# Altium project Switch_Matrix_32_2.PrjPCB (part 3 of 3)

## Sheet DIOT_Connectors_P1_P6.SchDoc: Switch Matrix 32:2
size 420 x 297 mm; SPICEModelCacheRMUUFYQV: <root> / <DocumentId>RMUUFYQV</DocumentId> / </root>; Author: G.Kasprowicz; CompanyName: WUT ISE; DrawnBy: G.Kasprowicz; Organization: WUT ISE; Address1: PW ISE; Address2: Nowowiejska 15/19 00-665 Warsaw; Address3: gkasprow@gmail.com; DocumentNumber: 5; Revision: 2; SheetNumber: 5; SheetTotal: 6; ModifiedBy: -; CheckedDate: -; Title2: DIOT connectors; DivGrp: WUT ISE; Designer: G.Kasprowicz; ModifiedDate: -; ProjectName: Sensor Box
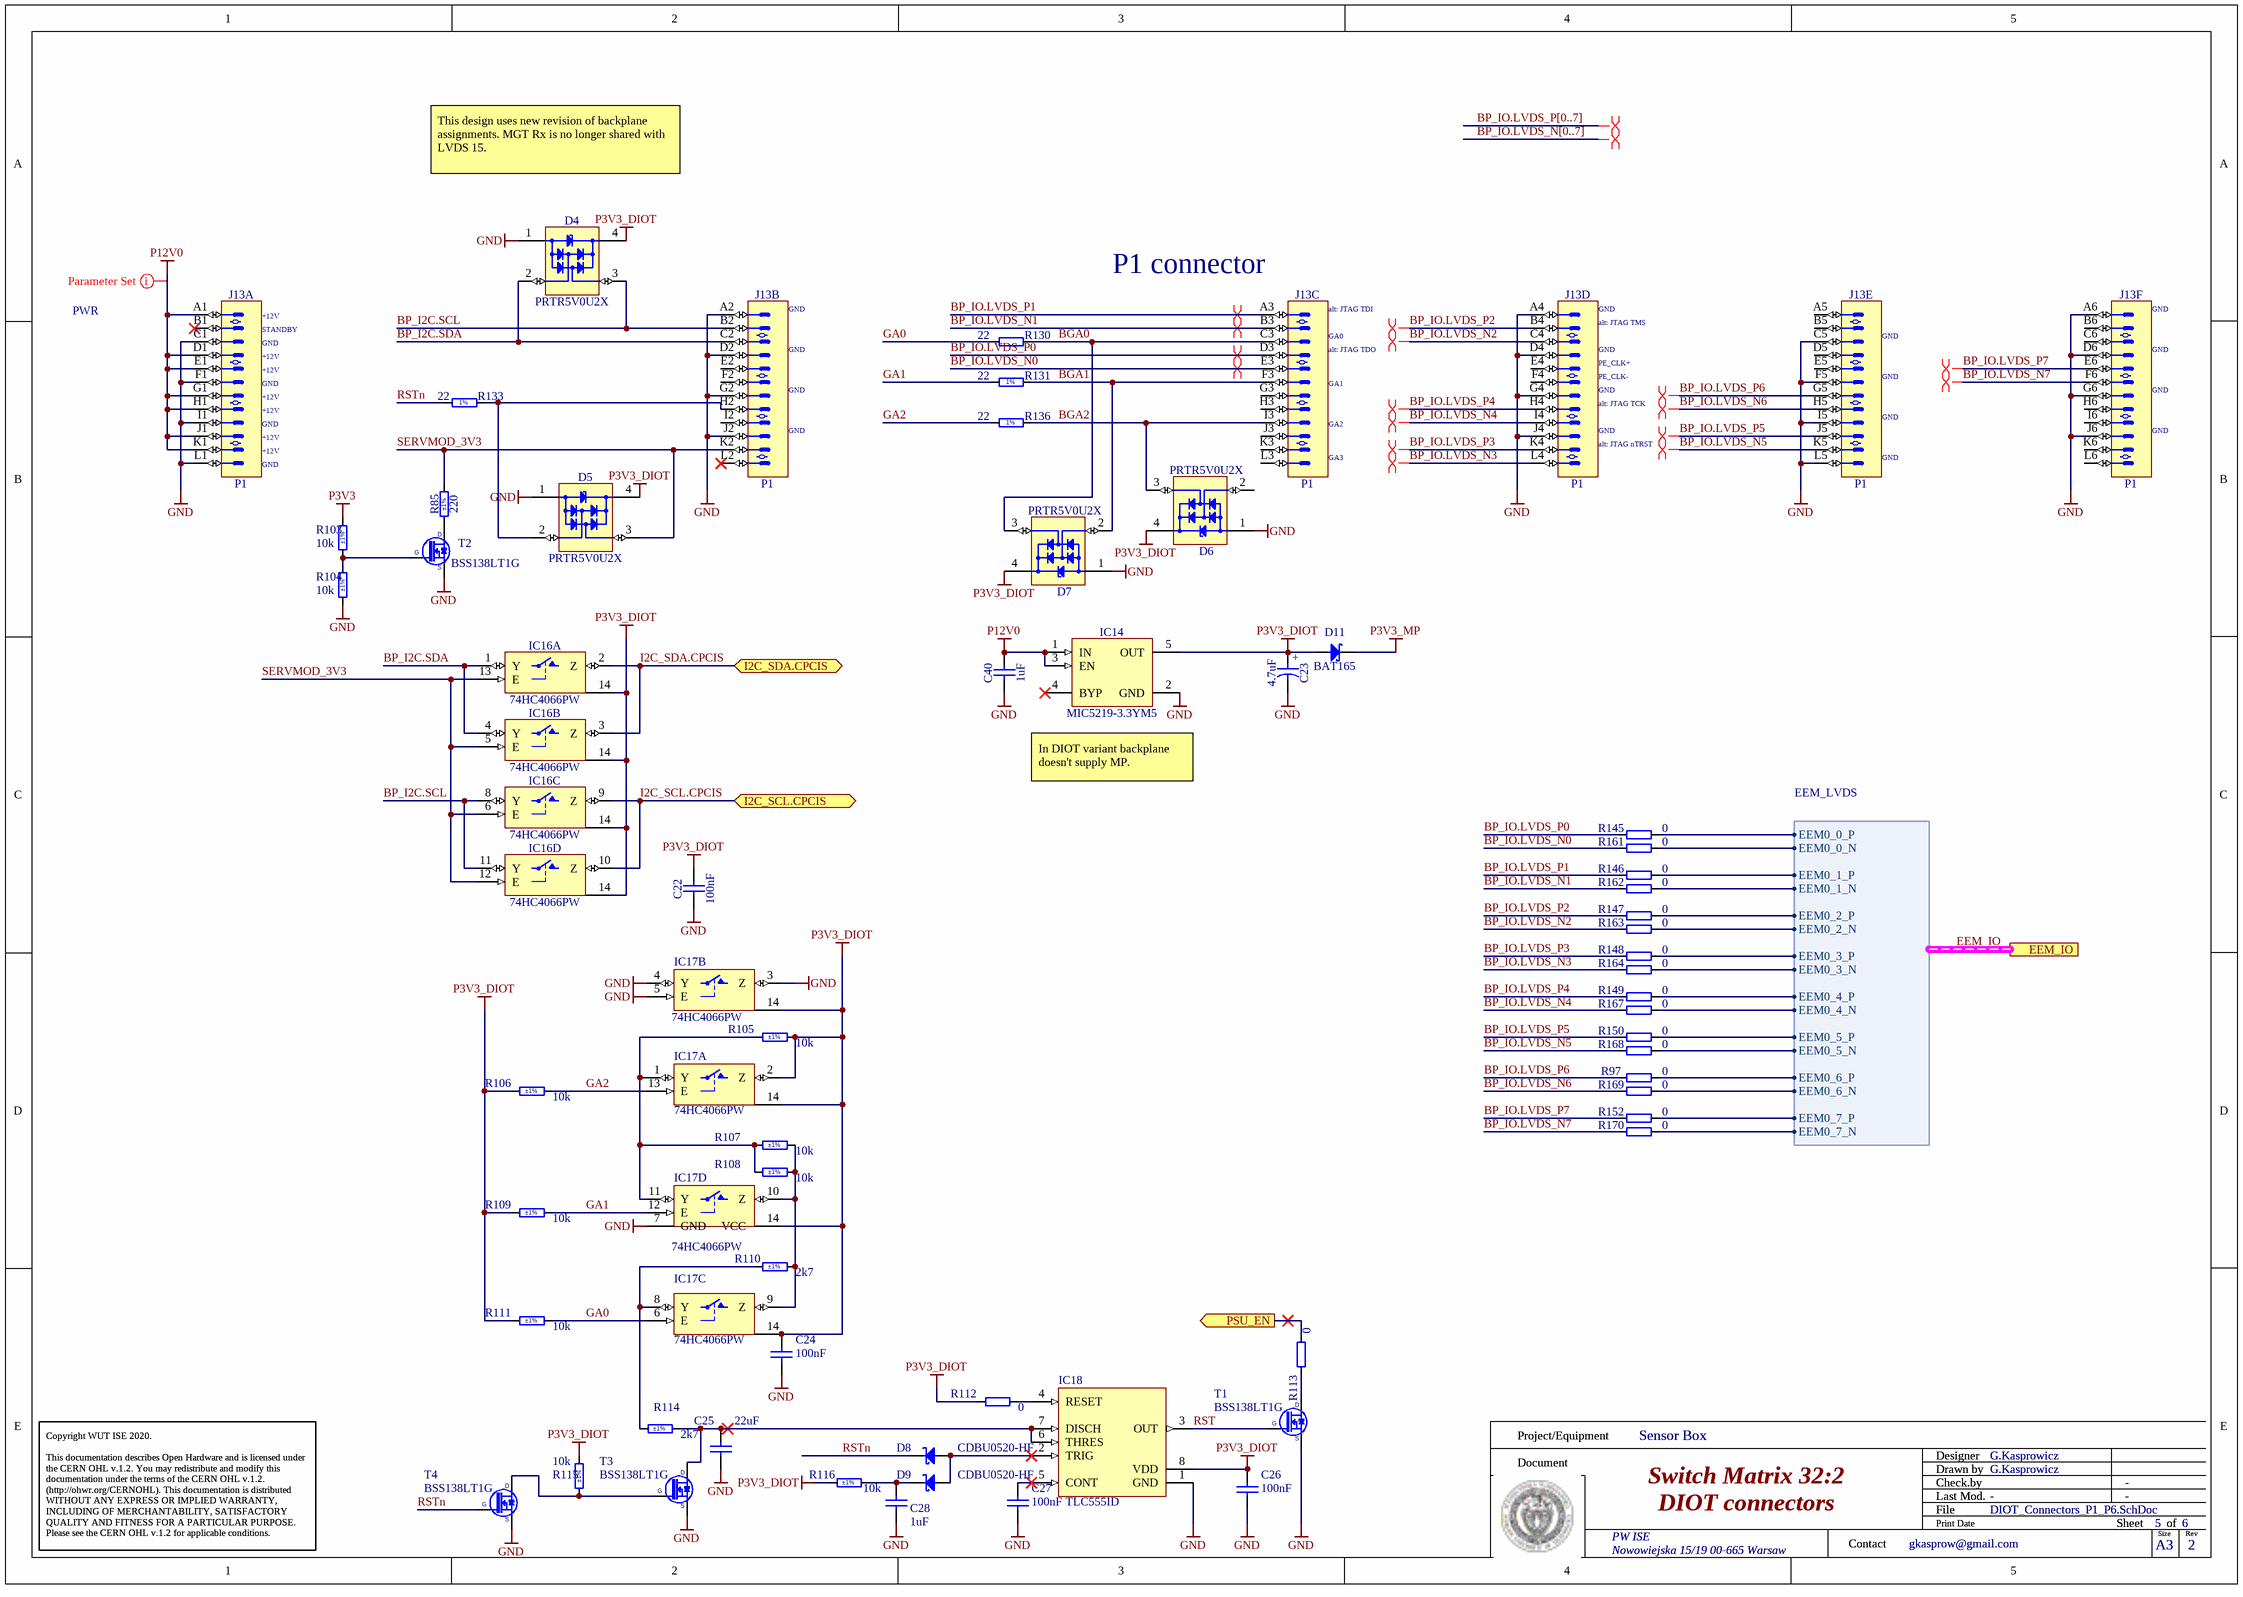
[diagram p5: DIOT_Connectors_P1_P6.SchDoc]

### Parts
C22  100nF  [CAPC1608X87N]
C23  4.7uF  [CAPMP3216X180N]
C24  100nF  [CAPC1608X87N]
C25  22uF  [CAPC2012X135N]
C26  100nF  [CAPC1608X87N]
C27  100nF  [CAPC1608X87N]
C28  1uF  [CAPC1608X87N]
C40  1uF  [CAPC1608X87N]
D4  PRTR5V0U2X  [SOT190P230X110-4N]
D5  PRTR5V0U2X  [SOT190P230X110-4N]
D6  PRTR5V0U2X  [SOT190P230X110-4N]
D7  PRTR5V0U2X  [SOT190P230X110-4N]
D8  CDBU0520-HF  [SOD-523F]
D9  CDBU0520-HF  [SOD-523F]
D11  BAT165  [SOD2512X110N]
IC14  MIC5219-3.3YM5  [SOT95P280X145-5N]
IC16  74HC4066PW  [SOP65P640X110-14N]  (parts A,B,C,D of 4)
IC17  74HC4066PW  [SOP65P640X110-14N]  (parts A,B,C,D of 4)
IC18  TLC555ID  [SOIC127P600X175-8N]
J13  P1  [AMPHENOL_10052825-101LF]  (parts A,B,C,D,E,F of 6)
R85  220  Tolerance: ±1%  [RESC1005X40N]
R97  0  [RESC1608X55N]
R103  10k  Tolerance: ±1%  [RESC1608X55N]
R104  10k  Tolerance: ±1%  [RESC1608X55N]
R105  10k  Tolerance: ±1%  [RESC1608X55N]
R106  10k  Tolerance: ±1%  [RESC1608X55N]
R107  10k  Tolerance: ±1%  [RESC1608X55N]
R108  10k  Tolerance: ±1%  [RESC1608X55N]
R109  10k  Tolerance: ±1%  [RESC1608X55N]
R110  2k7  Tolerance: ±1%  [RESC1608X55N]
R111  10k  Tolerance: ±1%  [RESC1608X55N]
R112  0  [RESC1608X55N]
R113  0  [RESC1608X55N]
R114  2k7  Tolerance: ±1%  [RESC1608X55N]
R115  10k  Tolerance: ±1%  [RESC1608X55N]
R116  10k  Tolerance: ±1%  [RESC1608X55N]
R130  22  [RESC1005X40N]
R131  22  [RESC1005X40N]
R133  22  [RESC1005X40N]
R136  22  [RESC1005X40N]
R145  0  [RESC1608X55N]
R146  0  [RESC1608X55N]
R147  0  [RESC1608X55N]
R148  0  [RESC1608X55N]
R149  0  [RESC1608X55N]
R150  0  [RESC1608X55N]
R152  0  [RESC1608X55N]
R161  0  [RESC1608X55N]
R162  0  [RESC1608X55N]
R163  0  [RESC1608X55N]
R164  0  [RESC1608X55N]
R167  0  [RESC1608X55N]
R168  0  [RESC1608X55N]
R169  0  [RESC1608X55N]
R170  0  [RESC1608X55N]
T1  BSS138LT1G  [SOT95P240X110-3N]
T2  BSS138LT1G  [SOT95P240X110-3N]
T3  BSS138LT1G  [SOT95P240X110-3N]
T4  BSS138LT1G  [SOT95P240X110-3N]

### Ports
EEM_IO (harness EEM_LVDS), I2C_SCL.CPCIS (bidir), I2C_SDA.CPCIS (bidir), PSU_EN (out)

### Harnesses
EEM_LVDS: EEM0_0_P, EEM0_0_N, EEM0_1_P, EEM0_1_N, EEM0_2_P, EEM0_2_N, EEM0_3_P, EEM0_3_N, EEM0_4_P, EEM0_4_N, EEM0_5_P, EEM0_5_N, EEM0_6_P, EEM0_6_N, EEM0_7_P, EEM0_7_N

### Nets
GND: C22.1 C23.2 C24.1 C25.1 C26.1 C27.1 C28.1 C40.1 D4.1(GND) D5.1(GND) D6.1(GND) D7.1(GND) IC14.2(GND) IC16.7(GND) IC17.3(Z) IC17.4(Y) IC17.5(E) IC17.7(GND) IC18.1(GND) J13.A2 J13.A4 J13.A6 J13.C1 J13.C5 J13.D2 J13.D4 J13.D6 J13.F1 J13.F5 J13.G2 J13.G4 J13.G6 J13.I1 J13.I5 J13.J2 J13.J4 J13.J6 J13.L1 J13.L5 R104.1 T1.2(S) T2.2(S) T3.2(S) T4.2(S)
P3V3: R103.2
P3V3_DIOT: C22.2 C23.1 C24.2 C26.2 D4.4(VCC) D5.4(VCC) D6.4(VCC) D7.4(VCC) D11.2(A) IC14.5(OUT) IC16.14(VCC) IC17.2(Z) IC17.14(VCC) IC18.8(VDD) R105.2 R106.1 R109.1 R111.1 R112.1 R115.2 R116.1
P3V3_MP: D11.1(C)
P12V0: C40.2 IC14.1(IN) IC14.3(EN) J13.A1 J13.D1 J13.E1 J13.G1 J13.H1 J13.J1 J13.K1
BGA0: D7.3(I/O2) J13.C3 R130.2
BGA1: D7.2(I/O1) J13.F3 R131.2
BGA2: D6.3(I/O2) J13.I3 R136.2
BP_I2C.SCL: D4.3(I/O2) IC16.8(Y) IC16.11(Y) J13.B2
BP_I2C.SDA: D4.2(I/O1) IC16.1(Y) IC16.4(Y) J13.C2
BP_IO.LVDS_N0: J13.E3 R161.1
BP_IO.LVDS_N1: J13.B3 R162.1
BP_IO.LVDS_N2: J13.C4 R163.1
BP_IO.LVDS_N3: J13.L4 R164.1
BP_IO.LVDS_N4: J13.I4 R167.1
BP_IO.LVDS_N5: J13.K5 R168.1
BP_IO.LVDS_N6: J13.H5 R169.1
BP_IO.LVDS_N7: J13.F6 R170.1
BP_IO.LVDS_P0: J13.D3 R145.1
BP_IO.LVDS_P1: J13.A3 R146.1
BP_IO.LVDS_P2: J13.B4 R147.1
BP_IO.LVDS_P3: J13.K4 R148.1
BP_IO.LVDS_P4: J13.H4 R149.1
BP_IO.LVDS_P5: J13.J5 R150.1
BP_IO.LVDS_P6: J13.G5 R97.1
BP_IO.LVDS_P7: J13.E6 R152.1
EEM0_0_N: R161.2 ; port EEM_IO.EEM0_0_N
EEM0_0_P: R145.2 ; port EEM_IO.EEM0_0_P
EEM0_1_N: R162.2 ; port EEM_IO.EEM0_1_N
EEM0_1_P: R146.2 ; port EEM_IO.EEM0_1_P
EEM0_2_N: R163.2 ; port EEM_IO.EEM0_2_N
EEM0_2_P: R147.2 ; port EEM_IO.EEM0_2_P
EEM0_3_N: R164.2 ; port EEM_IO.EEM0_3_N
EEM0_3_P: R148.2 ; port EEM_IO.EEM0_3_P
EEM0_4_N: R167.2 ; port EEM_IO.EEM0_4_N
EEM0_4_P: R149.2 ; port EEM_IO.EEM0_4_P
EEM0_5_N: R168.2 ; port EEM_IO.EEM0_5_N
EEM0_5_P: R150.2 ; port EEM_IO.EEM0_5_P
EEM0_6_N: R169.2 ; port EEM_IO.EEM0_6_N
EEM0_6_P: R97.2 ; port EEM_IO.EEM0_6_P
EEM0_7_N: R170.2 ; port EEM_IO.EEM0_7_N
EEM0_7_P: R152.2 ; port EEM_IO.EEM0_7_P
GA0: IC17.6(E) R111.2 R130.1
GA1: IC17.12(E) R109.2 R131.1
GA2: IC17.13(E) R106.2 R136.1
I2C_SCL.CPCIS: IC16.9(Z) IC16.10(Z) ; port I2C_SCL.CPCIS  [project net I2C0_SCL]
I2C_SDA.CPCIS: IC16.2(Z) IC16.3(Z) ; port I2C_SDA.CPCIS  [project net I2C0_SDA]
RST: IC18.3(OUT) T1.1(G)
RSTn: D8.1(C) R133.1 T4.1(G)
SERVMOD_3V3: D5.3(I/O2) IC16.5(E) IC16.6(E) IC16.12(E) IC16.13(E) J13.K2 R85.2
NetC25_2: C25.2 IC18.6(THRES) IC18.7(DISCH) R114.2 T3.3(D)
NetC27_2: C27.2 IC18.5(CONT)
NetC28_2: C28.2 D9.1(C) R116.2
NetD5_2: D5.2(I/O1) J13.H2 R133.2
NetD8_2: D8.2(A) D9.2(A) IC18.2(TRIG)
NetIC17_1: IC17.1(Y) IC17.11(Y) R105.1 R107.1 R108.1
NetIC17_8: IC17.8(Y) R110.1 R114.1
NetIC17_9: IC17.9(Z) IC17.10(Z) R107.2 R108.2 R110.2
NetIC18_4: IC18.4(RESET) R112.2
NetIC22_5: R113.2 ; port PSU_EN
NetR85_1: R85.1 T2.3(D)
NetR103_1: R103.1 R104.2 T2.1(G)
NetR113_1: R113.1 T1.3(D)
NetR115_1: R115.1 T3.1(G) T4.3(D)

Not connected (* = marked no-connect by the designer): D6 2(I/O1); IC14 4(BYP)*; J13 A5 B1* B5 B6 C6 D5 E2 E4 E5 F2 F4 G3 H3 H6 I2 I6 J3 K3 K6 L2* L3 L6

### Buses and harness runs
bus BP_IO.LVDS_N[0..7]
bus BP_IO.LVDS_P[0..7]
harness EEM_IO = port EEM_IO

### Layout directives
differential pair: (no net found under the mark), BP_IO.LVDS_N0, BP_IO.LVDS_N1, BP_IO.LVDS_N2, BP_IO.LVDS_N3, BP_IO.LVDS_N4, BP_IO.LVDS_N5, BP_IO.LVDS_N6, BP_IO.LVDS_N7, BP_IO.LVDS_P0, BP_IO.LVDS_P1, BP_IO.LVDS_P2, BP_IO.LVDS_P3, BP_IO.LVDS_P4, BP_IO.LVDS_P5, BP_IO.LVDS_P6, BP_IO.LVDS_P7
net class PWR: P12V0

### Notes on the sheet
- This design uses new revision of backplane assignments. MGT Rx is no longer shared with LVDS 15.
- (near J13) +12V
- (near J13) GND
- (near J13) P1 connector
- (near J13) alt: JTAG TDI
- (near J13) alt: JTAG TMS
- (near J13) STANDBY
- (near J13) alt: JTAG TDO
- (near J13) GA1
- (near J13) GA0
- (near J13) PE_CLK+
- (near J13) PE_CLK-
- (near J13) GA2
- (near J13) GA3
- (near J13) alt: JTAG TCK
- (near J13) alt: JTAG nTRST
- In DIOT variant backplane doesn't supply MP.
- Project/Equipment
- Document
- Designer
- Drawn by
- Check.by
- Copyright WUT ISE 2020.
  This documentation describes Open Hardware and is licensed under the CERN OHL v.1.2. You may redistribute and modify this documentation under the terms of the CERN OHL v.1.2. (http://ohwr.org/CERNOHL). This documentation is distributed WITHOUT ANY EXPRESS OR IMPLIED WARRANTY, INCLUDING OF MERCHANTABILITY, SATISFACTORY QUALITY AND FITNESS FOR A PARTICULAR PURPOSE. Please see the CERN OHL v.1.2 for applicable conditions.
- Contact
- File
- Last Mod.
- Print Date
- Sheet
- Size
- A3
- of
- Rev
- (in symbol CTE3216-18_4.7UF_10V_10%_AVX_TPSA475K010T1400) +
- (in symbol R0402_22R_1%_0.0625W_100PPM) 1%

### Library data of the parts
C22 C24 C26 C27 = CC0603_100NF_50V_10%_X7R: Non-polarised capacitor; Part Description: SMD Multilayer Chip Ceramic Capacitor; Manufacturer: GENERIC; Manufacturer1 Part Number: 223858615649; Voltage: 50V; TC: X7R; Tolerance: ±10%; Part Number: CC0603_100NF_50V_10%_X7R; Component Kind: Standard; Component Type: Standard; Pin Count: 2; Value: 100nF; Status: Preferred; Manufacturer Part Number: CC0603_100NF_50V_10%_X7R; Case: 0603; Mounted: Yes; Socket: No; SMD: Yes; Sense: No; Manufacturer1 Example: PHYCOMP; Manufacturer1 ComponentHeight: 0.87mm; HelpURL: \\cern.ch\dfs\Applications\Altium\Datasheets\CC0603_X7R_PHYCOMP.pdf; Author: CERN DEM JLC; CreateDate: 03.12.2007; LatestRevisionDate: 03.12.2007
C23 = CTE3216-18_4.7UF_10V_10%_AVX_TPSA475K010T1400: Polarised capacitor; Part Description: Low ESR 1R4 Automotive Solid Tantalum Chip Capacitor; Manufacturer: AVX; Voltage: 10V; Tolerance: ±10%; Part Number: CTE3216-18_4.7UF_10V_10%_AVX_TPSA475K010T1400; Component Kind: Standard; Component Type: Standard; Pin Count: 2; Value: 4.7uF; Status: Preferred; Manufacturer Part Number: TPSA475K010T1400; Case: A; Mounted: Yes; Socket: No; SMD: Yes; Sense: No; ComponentHeight: 1.8mm; HelpURL: \\cern.ch\dfs\Applications\Altium\Datasheets\CTE-LESR_AVX_TPS-AUTO.pdf; Author: CERN DEM JLC; CreateDate: 23.01.2018; LatestRevisionDate: 23.01.2018
C25 = CC0805_22UF_16V_10%_X5R: Non-polarised capacitor; Part Description: SMD Multilayer Chip Ceramic Capacitor; Manufacturer: GENERIC; Manufacturer1 Part Number: C2012X5R1C226KT; Voltage: 16V; TC: X5R; Tolerance: ±10%; Part Number: CC0805_22UF_16V_10%_X5R; Component Kind: Standard; Component Type: Standard; Pin Count: 2; Value: 22uF; Status: Preferred; Manufacturer Part Number: CC0805_22UF_16V_10%_X5R; Case: 0805; Mounted: Yes; Socket: No; SMD: Yes; Sense: No; Manufacturer1 Example: TDK; Manufacturer1 ComponentHeight: 1.35mm; HelpURL: \\cern.ch\dfs\Applications\Altium\Datasheets\CC0805_X5R_TDK_C.pdf; Author: CERN DEM JLC; CreateDate: 25.10.2012; LatestRevisionDate: 25.10.2012
C28 = CC0603_1UF_16V_10%_X7R: Non-polarised capacitor; Part Description: SMD Multilayer Chip Ceramic Capacitor; Manufacturer: GENERIC; Manufacturer1 Part Number: 223878615663; Voltage: 16V; TC: X7R; Tolerance: ±10%; Part Number: CC0603_1UF_16V_10%_X7R; Component Kind: Standard; Component Type: Standard; Pin Count: 2; Value: 1uF; Status: None; Manufacturer Part Number: CC0603_1UF_16V_10%_X7R; Case: 0603; Mounted: Yes; Socket: No; SMD: Yes; Sense: No; Manufacturer1 Example: YAGEO PHYCOMP; Manufacturer1 ComponentHeight: 0.9mm; HelpURL: \\cern.ch\dfs\Applications\Altium\Datasheets\CC0603_X7R_PHYCOMP.pdf; Author: CERN DEM JLC; CreateDate: 03.12.2007; LatestRevisionDate: 17.04.2015
C40 = CC0603_1UF_25V_10%_X7R: Non-polarised capacitor; Part Description: SMD Multilayer Chip Ceramic Capacitor; Manufacturer: GENERIC; Manufacturer1 Part Number: GRM188R71E105KA12D; Voltage: 25V; TC: X7R; Tolerance: ±10%; Part Number: CC0603_1UF_25V_10%_X7R; Component Kind: Standard; Component Type: Standard; Pin Count: 2; Value: 1uF; Status: None; Manufacturer Part Number: CC0603_1UF_25V_10%_X7R; Case: 0603; Mounted: Yes; Socket: No; SMD: Yes; Sense: No; Manufacturer1 Example: MURATA; Manufacturer1 ComponentHeight: 0.9mm; HelpURL: \\cern.ch\dfs\Applications\Altium\Datasheets\CC0603_X7R_MURATA.pdf; Author: CERN DEM JLC; CreateDate: 18.01.2011; LatestRevisionDate: 18.01.2011
D4-D7 = PRTR5V0U2X: Ultra Low Capacitance Double Rail-to-Rail ESD Protection Diode; Part Description: Ultra Low Capacitance (1pF) Double Rail-to-Rail ESD Protection Diode (8kV); Manufacturer: NXP SEMICONDUCTORS; Voltage: 5.5V; PressFit: No; Bonding: No; Part Number: PRTR5V0U2X; Component Kind: Standard; Component Type: Standard; Device: PRTR5V0U2X; PackageDescription: SOT143B, SOT, 1.90mm Pitch; 4 Pin, 1.30mm W X 2.90mm L X 1.10mm H body, IPC Medium Density; Manufacturer Part Number: PRTR5V0U2X; Pin Count: 4; Case: SOT143B; Mounted: Yes; Socket: No; SMD: Yes; Sense: No; ComponentHeight: 1.1mm; HelpURL: \\cern.ch\dfs\Applications\Altium\Datasheets\PRTR5V0U2X.pdf; Author: CERN DEM JLC; CreateDate: 22.03.2011; LatestRevisionDate: 22.03.2011
D8 D9 = CDBU0520-HF: Schottky Diode; Part Description: 20V Surface mount Schottky Barrier Diode; Manufacturer: COMCHIP; Voltage: 20V; Power: 500mA; PressFit: No; Bonding: No; Part Number: CDBU0520-HF; Component Kind: Standard; Component Type: Standard; Device: CDBU0520-HF; PackageDescription: Small Outline Diode Flat Lead (SOD-523F), Body; 1.80mm L X 1mm W X 0.85mm H; Manufacturer Part Number: CDBU0520-HF; Pin Count: 2; Case: SOD-523F; Mounted: Yes; Socket: No; SMD: Yes; Sense: No; ComponentHeight: 1mm; HelpURL: \\cern.ch\dfs\Applications\Altium\Datasheets\CDBU0520-HF.pdf; Author: CERN DEM HF; CreateDate: 13.10.2023; LatestRevisionDate: 13.10.2023
D11 = BAT165: Schottky Diode; Manufacturer: INFINEON; Part Description: Medium Power AF Schottky Diode; Voltage: 40V; Power: 750mA; PressFit: No; Bonding: No; Manufacturer Part Number: BAT165; PackageDescription: Small Outline Diode (SOD-323), 1.70mm W X 1.25mm L X 1.10mm H body,  IPC Medium Density; Part Number: BAT165; Component Kind: Standard; Component Type: Standard; Device: BAT165; Pin Count: 2; Case: SOD323; Mounted: Yes; Socket: No; SMD: Yes; Sense: No; ComponentHeight: 1.1mm; HelpURL: \\cern.ch\dfs\Applications\Altium\Datasheets\BAT165.pdf; Author: CERN DEM JLC; CreateDate: 12.11.2014; LatestRevisionDate: 12.11.2014
IC14 = MIC5219-3.3YM5: 500mA Peak Output LDO Regulator; Part Description: 3.3V 500mA Peak Output Low Drop-Out  (LDO) Regulator; Manufacturer: MICROCHIP TECHNOLOGY; PressFit: No; Bonding: No; Part Number: MIC5219-3.3YM5; Component Kind: Standard; Component Type: Standard; Device: MIC5219-3.3YM5; PackageDescription: SOT, 0.95mm pitch; 5 pin, 1.60mm W X 2.90mm L X 1.45mm H body, IPC Medium Density; Manufacturer Part Number: MIC5219-3.3YM5; Pin Count: 5; Case: SOT23-5; Mounted: Yes; Socket: No; SMD: Yes; Sense: No; ComponentHeight: 1.45mm; HelpURL: \\cern.ch\dfs\Applications\Altium\Datasheets\MIC5219-3.3YM5.pdf; Author: CERN DEM WB; CreateDate: 2019-04-16; LatestRevisionDate: 2019-04-16
IC16 = 74HC4066PW: Part Description: Quad Single-Pole Single-Throw Analog Switch; Manufacturer: NXP SEMICONDUCTORS; PressFit: No; Bonding: No; Part Number: 74HC4066PW; Component Kind: Standard; Component Type: Standard; Device: 74HC4066PW; PackageDescription: SOP, 14-Leads, Body 4.4x5mm (max), Pitch 0.65mm, IPC Medium Density; Manufacturer Part Number: 74HC4066PW; Pin Count: 14; Case: TSSOP14; Mounted: Yes; Socket: No; SMD: Yes; Sense: No; ComponentHeight: 1.1mm; Author: CERN DEM JLC; HelpURL: \\cern.ch\dfs\Applications\Altium\Datasheets\74HC4066PW.pdf; CreateDate: 19.11.2014; LatestRevisionDate: 19.11.2014
IC17 = 74HC4066PW: Part Description: Quad Single-Pole Single-Throw Analog Switch; Manufacturer: NXP SEMICONDUCTORS; PressFit: No; Bonding: No; Table: Standard Logic; Part Number: 74HC4066PW; Component Kind: Standard; Component Type: Standard; Device: 74HC4066PW; PackageDescription: SOP, 14-Leads, Body 4.4x5mm (max), Pitch 0.65mm, IPC Medium Density; Manufacturer Part Number: 74HC4066PW; Pin Count: 14; Case: TSSOP14; Mounted: Yes; Socket: No; SMD: Yes; ComponentHeight: 1.1mm; Author: CERN DEM JLC; HelpURL: \\cern.ch\dfs\Applications\Altium\Datasheets\74HC4066PW.pdf; CreateDate: 2014-11-19; LatestRevisionDate: 2014-11-19
IC18 = TLC555ID: LinCMOS Timer; Manufacturer: TEXAS INSTRUMENTS; PressFit: No; Bonding: No; Part Number: TLC555ID; Component Kind: Standard; Component Type: Standard; Device: TLC555ID; PackageDescription: SOIC 8, Pitch 1.27mm, Body 4x5mm, IPC Medium Density; Part Description: LinCMOS Timer; Manufacturer Part Number: TLC555ID; Pin Count: 8; Case: SOIC8; Mounted: Yes; Socket: No; SMD: Yes; Sense: No; ComponentHeight: 1.75mm; Author: CERN DEM JMW; HelpURL: \\cern.ch\dfs\Applications\Altium\Datasheets\TLC555ID.pdf; CreateDate: 23.08.2016; LatestRevisionDate: 23.08.2016
J13 = AMPHENOL_10052825-101LF: 72 Contacts Header, 6 Columns, 4 Pairs per Column; Part Description: 72 Contacts, 2mm Pitch, 6 Columns, 4 Pairs per Column, 4 Walls, Right Angle Header; Part Number: AMPHENOL_10052825-101LF; Component Kind: Standard; Component Type: Standard; Pin Count: 72; Family: AirMax VS; Mounted: Yes; Socket: No; SMD: No; PressFit: Yes; Sense: No; Status: None; Manufacturer: AMPHENOL; Manufacturer Part Number: 10052825-101LF; ComponentHeight: 15.35mm; HelpURL: \\cern.ch\dfs\Applications\Altium\Datasheets\AMPHENOL_10052825-101LF.pdf; ComponentLink1URL: \\cern.ch\dfs\Applications\Altium\Datasheets\AMPHENOL_10052825-101LF_Application.pdf; ComponentLink1Description: Application; Author: CERN DEM MR; CreateDate: 19/02/2018; LatestRevisionDate: 19/02/2018; Classname: Overlapping
R85 = R0402_220R_1%_0.0625W_100PPM: Resistor - 1%; Part Description: General Purpose Thick Film Chip Resistor; Manufacturer: GENERIC; Manufacturer1 Part Number: 232270672201L; TC: ±100ppm/°C; PressFit: No; Part Number: R0402_220R_1%_0.0625W_100PPM; Component Kind: Standard; Component Type: Standard; Pin Count: 2; Value: 220; Status: Not Recommended; Power: 0.0625W; Manufacturer Part Number: R0402_220R_1%_0.0625W_100PPM; Case: 0402; Mounted: Yes; Sense: No; Socket: No; SMD: Yes; Manufacturer1 Example: YAGEO PHYCOMP; Manufacturer1 ComponentHeight: 0.4mm; HelpURL: \\cern.ch\dfs\Applications\Altium\Datasheets\R0402_Phycomp_RC0402.pdf; Author: CERN DEM JLC; CreateDate: 03.12.2007; LatestRevisionDate: 17.10.2012
R97 R112 R113 R145-R150 R152 R161-R164 R167-R170 = R0603_0R_JUMPER: Resistor; Part Description: 1A (0.05R Max DC Resistance) Zero Ohm Jumper; Manufacturer: GENERIC; Manufacturer1 Part Number: NRC06Z0; PressFit: No; Part Number: R0603_0R_JUMPER; Component Kind: Standard; Component Type: Standard; Pin Count: 2; Value: 0; Status: Preferred; Manufacturer Part Number: R0603_0R_JUMPER; Case: 0603; Mounted: Yes; Sense: No; Socket: No; SMD: Yes; Manufacturer1 Example: NIC COMPONENT; Manufacturer1 ComponentHeight: 0.55mm; HelpURL: \\cern.ch\dfs\Applications\Altium\Datasheets\R0603_NIC_NRC.pdf; Author: CERN DEM JLC; CreateDate: 03.12.2007; LatestRevisionDate: 13.03.2008
R103-R109 R111 R115 R116 = R0603_10K_1%_0.1W_100PPM: Resistor - 1%; Part Description: General Purpose Thick Film Chip Resistor; Manufacturer: GENERIC; Manufacturer1 Part Number: NRC06F1002TRF; Power: 0.1W; TC: ±100ppm/°C; PressFit: No; Part Number: R0603_10K_1%_0.1W_100PPM; Component Kind: Standard; Component Type: Standard; Pin Count: 2; Value: 10k; Status: Preferred; Manufacturer Part Number: R0603_10K_1%_0.1W_100PPM; Case: 0603; Mounted: Yes; Sense: No; Socket: No; SMD: Yes; Manufacturer1 Example: NIC COMPONENT; Manufacturer1 ComponentHeight: 0.55mm; HelpURL: \\cern.ch\dfs\Applications\Altium\Datasheets\R0603_NIC_NRC.pdf; Author: CERN DEM JLC; CreateDate: 03.12.2007; LatestRevisionDate: 13.03.2008
R110 R114 = R0603_2K7_1%_0.1W_100PPM: Resistor - 1%; Part Description: General Purpose Thick Film Chip Resistor; Manufacturer: GENERIC; Manufacturer1 Part Number: RC0603FR-072K7L; Power: 0.1W; TC: ±100ppm/°C; PressFit: No; Part Number: R0603_2K7_1%_0.1W_100PPM; Component Kind: Standard; Component Type: Standard; Pin Count: 2; Value: 2k7; Status: Preferred; Manufacturer Part Number: R0603_2K7_1%_0.1W_100PPM; Case: 0603; Mounted: Yes; Sense: No; Socket: No; SMD: Yes; Manufacturer1 Example: YAGEO PHYCOMP; Manufacturer1 ComponentHeight: 0.55mm; HelpURL: \\cern.ch\dfs\Applications\Altium\Datasheets\R0603_PHYCOMP_RC0603.pdf; Author: CERN DEM JLC; CreateDate: 02.05.2011; LatestRevisionDate: 02.05.2011
R130 R131 R133 R136 = R0402_22R_1%_0.0625W_100PPM: Resistor - 1%; Part Description: General Purpose Thick Film Chip Resistor; Manufacturer: GENERIC; Manufacturer1 Part Number: 232270672209L; PressFit: No; Part Number: R0402_22R_1%_0.0625W_100PPM; Component Kind: Standard; Component Type: Standard; Pin Count: 2; Value: 22; Status: Not Recommended; Power: 0.0625W; Tolerance: ±1%; Manufacturer Part Number: R0402_22R_1%_0.0625W_100PPM; Case: 0402; Mounted: Yes; Socket: No; SMD: Yes; Manufacturer1 Example: YAGEO PHYCOMP; Manufacturer1 ComponentHeight: 0.4mm; HelpURL: \\cern.ch\dfs\Applications\Altium\Datasheets\R0402_Phycomp_RC0402.pdf; Author: CERN DEM JLC; CreateDate: 03.12.2007; LatestRevisionDate: 17.10.2012; Sense: No
T1-T4 = BSS138LT1G: N-CHANNEL MOSFET WITH DIODE; Part Description: 50V, 200mA N-Channel Enhancement Mode Field-Effect Transistor; Manufacturer: ON SEMICONDUCTOR; PressFit: No; Bonding: No; Part Number: BSS138LT1G; Component Kind: Standard; Component Type: Standard; Device: BSS138LT1G; PackageDescription: SOT23, 0.95mm Pitch; 3 Pin, 1.40mm W X 3.00mm L X 1.10mm H body, IPC Medium Density; Manufacturer Part Number: BSS138L; Pin Count: 3; Case: SOT23-3; Mounted: Yes; Socket: No; SMD: Yes; Sense: No; ComponentHeight: 1.11mm; HelpURL: \\cern.ch\dfs\Applications\Altium\Datasheets\BSS138LT1G.pdf; Author: CERN DEM JLC; CreateDate: 23.03.2009; LatestRevisionDate: 25.05.2022

## Nets that join several sheets
GND: Switch_Matrix_32_2 (55 pins), Switch_Matrix_32_2_EEM (43 pins), Switch_Matrix_32_2_Supply (19 pins), Relay_channel1 (RL1A.9 RL2A.9), Relay_channel2 (RL1B.9 RL2B.9), Relay_channel3 (RL1C.9 RL2C.9), Relay_channel4 (RL1D.9 RL2D.9), Relay_channel5 (RL1E.9 RL2E.9), Relay_channel6 (RL1F.9 RL2F.9), Relay_channel7 (RL1G.9 RL2G.9), Relay_channel8 (RL1H.9 RL2H.9), Relay_channel9 (RL1I.9 RL2I.9), Relay_channel10 (RL1J.9 RL2J.9), Relay_channel11 (RL1K.9 RL2K.9), Relay_channel12 (RL1L.9 RL2L.9), Relay_channel13 (RL1M.9 RL2M.9), Relay_channel14 (RL1N.9 RL2N.9), Relay_channel15 (RL1O.9 RL2O.9), Relay_channel16 (RL1P.9 RL2P.9), Relay_channel17 (RL1Q.9 RL2Q.9), Relay_channel18 (RL1R.9 RL2R.9), Relay_channel19 (RL1S.9 RL2S.9), Relay_channel20 (RL1T.9 RL2T.9), Relay_channel21 (RL1U.9 RL2U.9), Relay_channel22 (RL1V.9 RL2V.9), Relay_channel23 (RL1W.9 RL2W.9), Relay_channel24 (RL1X.9 RL2X.9), Relay_channel25 (RL1Y.9 RL2Y.9), Relay_channel26 (RL1Z.9 RL2Z.9), Relay_channel27 (RL127.9 RL227.9), Relay_channel28 (RL128.9 RL228.9), Relay_channel29 (RL129.9 RL229.9), Relay_channel30 (RL130.9 RL230.9), Relay_channel31 (RL131.9 RL231.9), Relay_channel32 (RL132.9 RL232.9), CTRLA (40 pins), CTRLB (40 pins), DIOT_Connectors_P1_P6 (44 pins)
P3V3: Switch_Matrix_32_2 (R19#1.2), Switch_Matrix_32_2_EEM (14 pins), Switch_Matrix_32_2_Supply (7 pins), CTRLA (12 pins), CTRLB (12 pins), DIOT_Connectors_P1_P6 (R103.2)
P3V3_MP: Switch_Matrix_32_2 (D3.1 R18#1.2), Switch_Matrix_32_2_EEM (16 pins), Switch_Matrix_32_2_Supply (D2.1 R160.1), DIOT_Connectors_P1_P6 (D11.1)
P12V0: Switch_Matrix_32_2 (R87.2), Switch_Matrix_32_2_EEM (J6.28 J6.29), Switch_Matrix_32_2_Supply (10 pins), DIOT_Connectors_P1_P6 (10 pins)
P12V0A: Switch_Matrix_32_2_Supply (C16.2 C17.2 L2.2), Relay_channel1 (RL1A.1 RL2A.1), Relay_channel2 (RL1B.1 RL2B.1), Relay_channel3 (RL1C.1 RL2C.1), Relay_channel4 (RL1D.1 RL2D.1), Relay_channel5 (RL1E.1 RL2E.1), Relay_channel6 (RL1F.1 RL2F.1), Relay_channel7 (RL1G.1 RL2G.1), Relay_channel8 (RL1H.1 RL2H.1), Relay_channel9 (RL1I.1 RL2I.1), Relay_channel10 (RL1J.1 RL2J.1), Relay_channel11 (RL1K.1 RL2K.1), Relay_channel12 (RL1L.1 RL2L.1), Relay_channel13 (RL1M.1 RL2M.1), Relay_channel14 (RL1N.1 RL2N.1), Relay_channel15 (RL1O.1 RL2O.1), Relay_channel16 (RL1P.1 RL2P.1), Relay_channel17 (RL1Q.1 RL2Q.1), Relay_channel18 (RL1R.1 RL2R.1), Relay_channel19 (RL1S.1 RL2S.1), Relay_channel20 (RL1T.1 RL2T.1), Relay_channel21 (RL1U.1 RL2U.1), Relay_channel22 (RL1V.1 RL2V.1), Relay_channel23 (RL1W.1 RL2W.1), Relay_channel24 (RL1X.1 RL2X.1), Relay_channel25 (RL1Y.1 RL2Y.1), Relay_channel26 (RL1Z.1 RL2Z.1), Relay_channel27 (RL127.1 RL227.1), Relay_channel28 (RL128.1 RL228.1), Relay_channel29 (RL129.1 RL229.1), Relay_channel30 (RL130.1 RL230.1), Relay_channel31 (RL131.1 RL231.1), Relay_channel32 (RL132.1 RL232.1)
ARDU_CSnA: Switch_Matrix_32_2 (J14.12), Switch_Matrix_32_2_EEM (IC8.13)
ARDU_CSnB: Switch_Matrix_32_2 (J14.11), Switch_Matrix_32_2_EEM (IC8.1)
ARDU_MISO: Switch_Matrix_32_2 (J14.15), Switch_Matrix_32_2_EEM (IC1.3)
ARDU_MOSI: Switch_Matrix_32_2 (J14.14), Switch_Matrix_32_2_EEM (IC1.13)
ARDU_MUX: Switch_Matrix_32_2 (J14.9 R96.2), Switch_Matrix_32_2_EEM (10 pins)
ARDU_OE: Switch_Matrix_32_2 (J14.10 R95.2), Switch_Matrix_32_2_EEM (IC8.3)
ARDU_SCK: Switch_Matrix_32_2 (J11.1), Switch_Matrix_32_2_EEM (IC1.1)
ARDU_SCL: Switch_Matrix_32_2 (J11.9), Switch_Matrix_32_2_EEM (IC12.8 IC12.11 R102.2)
ARDU_SDA: Switch_Matrix_32_2 (J11.8), Switch_Matrix_32_2_EEM (IC12.1 IC12.4 R101.2)
CTRL1: Relay_channel1 (RL2A.10), CTRLB (R2B.2)
CTRL1: Relay_channel1 (RL1A.10), CTRLA (R2A.2)
CTRL2: Relay_channel2 (RL2B.10), CTRLB (R4B.2)
CTRL2: Relay_channel2 (RL1B.10), CTRLA (R4A.2)
CTRL3: Relay_channel3 (RL2C.10), CTRLB (R6B.2)
CTRL3: Relay_channel3 (RL1C.10), CTRLA (R6A.2)
CTRL4: Relay_channel4 (RL2D.10), CTRLB (R74B.2)
CTRL4: Relay_channel4 (RL1D.10), CTRLA (R74A.2)
CTRL5: Relay_channel5 (RL2E.10), CTRLB (R76B.2)
CTRL5: Relay_channel5 (RL1E.10), CTRLA (R76A.2)
CTRL6: Relay_channel6 (RL2F.10), CTRLB (R78B.2)
CTRL6: Relay_channel6 (RL1F.10), CTRLA (R78A.2)
CTRL7: Relay_channel7 (RL2G.10), CTRLB (R80B.2)
CTRL7: Relay_channel7 (RL1G.10), CTRLA (R80A.2)
CTRL8: Relay_channel8 (RL2H.10), CTRLB (R82B.2)
CTRL8: Relay_channel8 (RL1H.10), CTRLA (R82A.2)
CTRL9: Relay_channel9 (RL2I.10), CTRLB (R84B.2)
CTRL9: Relay_channel9 (RL1I.10), CTRLA (R84A.2)
CTRL10: Relay_channel10 (RL2J.10), CTRLB (R22B.2)
CTRL10: Relay_channel10 (RL1J.10), CTRLA (R22A.2)
CTRL11: Relay_channel11 (RL2K.10), CTRLB (R25B.2)
CTRL11: Relay_channel11 (RL1K.10), CTRLA (R25A.2)
CTRL12: Relay_channel12 (RL2L.10), CTRLB (R27B.2)
CTRL12: Relay_channel12 (RL1L.10), CTRLA (R27A.2)
CTRL13: Relay_channel13 (RL2M.10), CTRLB (R29B.2)
CTRL13: Relay_channel13 (RL1M.10), CTRLA (R29A.2)
CTRL14: Relay_channel14 (RL2N.10), CTRLB (R31B.2)
CTRL14: Relay_channel14 (RL1N.10), CTRLA (R31A.2)
CTRL15: Relay_channel15 (RL2O.10), CTRLB (R33B.2)
CTRL15: Relay_channel15 (RL1O.10), CTRLA (R33A.2)
CTRL16: Relay_channel16 (RL2P.10), CTRLB (R35B.2)
CTRL16: Relay_channel16 (RL1P.10), CTRLA (R35A.2)
CTRL17: Relay_channel17 (RL2Q.10), CTRLB (R37B.2)
CTRL17: Relay_channel17 (RL1Q.10), CTRLA (R37A.2)
CTRL18: Relay_channel18 (RL2R.10), CTRLB (R39B.2)
CTRL18: Relay_channel18 (RL1R.10), CTRLA (R39A.2)
CTRL19: Relay_channel19 (RL2S.10), CTRLB (R41B.2)
CTRL19: Relay_channel19 (RL1S.10), CTRLA (R41A.2)
CTRL20: Relay_channel20 (RL2T.10), CTRLB (R43B.2)
CTRL20: Relay_channel20 (RL1T.10), CTRLA (R43A.2)
CTRL21: Relay_channel21 (RL2U.10), CTRLB (R45B.2)
CTRL21: Relay_channel21 (RL1U.10), CTRLA (R45A.2)
CTRL22: Relay_channel22 (RL2V.10), CTRLB (R47B.2)
CTRL22: Relay_channel22 (RL1V.10), CTRLA (R47A.2)
CTRL23: Relay_channel23 (RL2W.10), CTRLB (R49B.2)
CTRL23: Relay_channel23 (RL1W.10), CTRLA (R49A.2)
CTRL24: Relay_channel24 (RL2X.10), CTRLB (R51B.2)
CTRL24: Relay_channel24 (RL1X.10), CTRLA (R51A.2)
CTRL25: Relay_channel25 (RL2Y.10), CTRLB (R53B.2)
CTRL25: Relay_channel25 (RL1Y.10), CTRLA (R53A.2)
CTRL26: Relay_channel26 (RL2Z.10), CTRLB (R55B.2)
CTRL26: Relay_channel26 (RL1Z.10), CTRLA (R55A.2)
CTRL27: Relay_channel27 (RL227.10), CTRLB (R58B.2)
CTRL27: Relay_channel27 (RL127.10), CTRLA (R58A.2)
CTRL28: Relay_channel28 (RL228.10), CTRLB (R60B.2)
CTRL28: Relay_channel28 (RL128.10), CTRLA (R60A.2)
CTRL29: Relay_channel29 (RL229.10), CTRLB (R62B.2)
CTRL29: Relay_channel29 (RL129.10), CTRLA (R62A.2)
CTRL30: Relay_channel30 (RL230.10), CTRLB (R64B.2)
CTRL30: Relay_channel30 (RL130.10), CTRLA (R64A.2)
CTRL31: Relay_channel31 (RL231.10), CTRLB (R66B.2)
CTRL31: Relay_channel31 (RL131.10), CTRLA (R66A.2)
CTRL32: Relay_channel32 (RL232.10), CTRLB (R68B.2)
CTRL32: Relay_channel32 (RL132.10), CTRLA (R68A.2)
DAC_IN_N1: Switch_Matrix_32_2 (J8.2), Relay_channel1 (RL1A.6)
DAC_IN_N2: Switch_Matrix_32_2 (J8.5), Relay_channel2 (RL1B.6)
DAC_IN_N3: Switch_Matrix_32_2 (J8.8), Relay_channel3 (RL1C.6)
DAC_IN_N4: Switch_Matrix_32_2 (J8.11), Relay_channel4 (RL1D.6)
DAC_IN_N5: Switch_Matrix_32_2 (J8.14), Relay_channel5 (RL1E.6)
DAC_IN_N6: Switch_Matrix_32_2 (J8.17), Relay_channel6 (RL1F.6)
DAC_IN_N7: Switch_Matrix_32_2 (J8.20), Relay_channel7 (RL1G.6)
DAC_IN_N8: Switch_Matrix_32_2 (J8.23), Relay_channel8 (RL1H.6)
DAC_IN_N9: Switch_Matrix_32_2 (J4.2), Relay_channel9 (RL1I.6)
DAC_IN_N10: Switch_Matrix_32_2 (J4.5), Relay_channel10 (RL1J.6)
DAC_IN_N11: Switch_Matrix_32_2 (J4.8), Relay_channel11 (RL1K.6)
DAC_IN_N12: Switch_Matrix_32_2 (J4.11), Relay_channel12 (RL1L.6)
DAC_IN_N13: Switch_Matrix_32_2 (J4.14), Relay_channel13 (RL1M.6)
DAC_IN_N14: Switch_Matrix_32_2 (J4.17), Relay_channel14 (RL1N.6)
DAC_IN_N15: Switch_Matrix_32_2 (J4.20), Relay_channel15 (RL1O.6)
DAC_IN_N16: Switch_Matrix_32_2 (J4.23), Relay_channel16 (RL1P.6)
DAC_IN_N17: Switch_Matrix_32_2 (J5.2), Relay_channel17 (RL1Q.6)
DAC_IN_N18: Switch_Matrix_32_2 (J5.5), Relay_channel18 (RL1R.6)
DAC_IN_N19: Switch_Matrix_32_2 (J5.8), Relay_channel19 (RL1S.6)
DAC_IN_N20: Switch_Matrix_32_2 (J5.11), Relay_channel20 (RL1T.6)
DAC_IN_N21: Switch_Matrix_32_2 (J5.14), Relay_channel21 (RL1U.6)
DAC_IN_N22: Switch_Matrix_32_2 (J5.17), Relay_channel22 (RL1V.6)
DAC_IN_N23: Switch_Matrix_32_2 (J5.20), Relay_channel23 (RL1W.6)
DAC_IN_N24: Switch_Matrix_32_2 (J5.23), Relay_channel24 (RL1X.6)
DAC_IN_N25: Switch_Matrix_32_2 (J7.2), Relay_channel25 (RL1Y.6)
DAC_IN_N26: Switch_Matrix_32_2 (J7.5), Relay_channel26 (RL1Z.6)
DAC_IN_N27: Switch_Matrix_32_2 (J7.8), Relay_channel27 (RL127.6)
DAC_IN_N28: Switch_Matrix_32_2 (J7.11), Relay_channel28 (RL128.6)
DAC_IN_N29: Switch_Matrix_32_2 (J7.14), Relay_channel29 (RL129.6)
DAC_IN_N30: Switch_Matrix_32_2 (J7.17), Relay_channel30 (RL130.6)
DAC_IN_N31: Switch_Matrix_32_2 (J7.20), Relay_channel31 (RL131.6)
DAC_IN_N32: Switch_Matrix_32_2 (J7.23), Relay_channel32 (RL132.6)
DAC_IN_P1: Switch_Matrix_32_2 (J8.1), Relay_channel1 (RL1A.4)
DAC_IN_P2: Switch_Matrix_32_2 (J8.4), Relay_channel2 (RL1B.4)
DAC_IN_P3: Switch_Matrix_32_2 (J8.7), Relay_channel3 (RL1C.4)
DAC_IN_P4: Switch_Matrix_32_2 (J8.10), Relay_channel4 (RL1D.4)
DAC_IN_P5: Switch_Matrix_32_2 (J8.13), Relay_channel5 (RL1E.4)
DAC_IN_P6: Switch_Matrix_32_2 (J8.16), Relay_channel6 (RL1F.4)
DAC_IN_P7: Switch_Matrix_32_2 (J8.19), Relay_channel7 (RL1G.4)
DAC_IN_P8: Switch_Matrix_32_2 (J8.22), Relay_channel8 (RL1H.4)
DAC_IN_P9: Switch_Matrix_32_2 (J4.1), Relay_channel9 (RL1I.4)
DAC_IN_P10: Switch_Matrix_32_2 (J4.4), Relay_channel10 (RL1J.4)
DAC_IN_P11: Switch_Matrix_32_2 (J4.7), Relay_channel11 (RL1K.4)
DAC_IN_P12: Switch_Matrix_32_2 (J4.10), Relay_channel12 (RL1L.4)
DAC_IN_P13: Switch_Matrix_32_2 (J4.13), Relay_channel13 (RL1M.4)
DAC_IN_P14: Switch_Matrix_32_2 (J4.16), Relay_channel14 (RL1N.4)
DAC_IN_P15: Switch_Matrix_32_2 (J4.19), Relay_channel15 (RL1O.4)
DAC_IN_P16: Switch_Matrix_32_2 (J4.22), Relay_channel16 (RL1P.4)
DAC_IN_P17: Switch_Matrix_32_2 (J5.1), Relay_channel17 (RL1Q.4)
DAC_IN_P18: Switch_Matrix_32_2 (J5.4), Relay_channel18 (RL1R.4)
DAC_IN_P19: Switch_Matrix_32_2 (J5.7), Relay_channel19 (RL1S.4)
DAC_IN_P20: Switch_Matrix_32_2 (J5.10), Relay_channel20 (RL1T.4)
DAC_IN_P21: Switch_Matrix_32_2 (J5.13), Relay_channel21 (RL1U.4)
DAC_IN_P22: Switch_Matrix_32_2 (J5.16), Relay_channel22 (RL1V.4)
DAC_IN_P23: Switch_Matrix_32_2 (J5.19), Relay_channel23 (RL1W.4)
DAC_IN_P24: Switch_Matrix_32_2 (J5.22), Relay_channel24 (RL1X.4)
DAC_IN_P25: Switch_Matrix_32_2 (J7.1), Relay_channel25 (RL1Y.4)
DAC_IN_P26: Switch_Matrix_32_2 (J7.4), Relay_channel26 (RL1Z.4)
DAC_IN_P27: Switch_Matrix_32_2 (J7.7), Relay_channel27 (RL127.4)
DAC_IN_P28: Switch_Matrix_32_2 (J7.10), Relay_channel28 (RL128.4)
DAC_IN_P29: Switch_Matrix_32_2 (J7.13), Relay_channel29 (RL129.4)
DAC_IN_P30: Switch_Matrix_32_2 (J7.16), Relay_channel30 (RL130.4)
DAC_IN_P31: Switch_Matrix_32_2 (J7.19), Relay_channel31 (RL131.4)
DAC_IN_P32: Switch_Matrix_32_2 (J7.22), Relay_channel32 (RL132.4)
DAC_OUT_N1: Switch_Matrix_32_2 (J1.35), Relay_channel1 (R99A.1 RL2A.8)
DAC_OUT_N2: Switch_Matrix_32_2 (J1.36), Relay_channel2 (R99B.1 RL2B.8)
DAC_OUT_N3: Switch_Matrix_32_2 (J1.37), Relay_channel3 (R99C.1 RL2C.8)
DAC_OUT_N4: Switch_Matrix_32_2 (J1.38), Relay_channel4 (R99D.1 RL2D.8)
DAC_OUT_N5: Switch_Matrix_32_2 (J1.39), Relay_channel5 (R99E.1 RL2E.8)
DAC_OUT_N6: Switch_Matrix_32_2 (J1.40), Relay_channel6 (R99F.1 RL2F.8)
DAC_OUT_N7: Switch_Matrix_32_2 (J1.41), Relay_channel7 (R99G.1 RL2G.8)
DAC_OUT_N8: Switch_Matrix_32_2 (J1.42), Relay_channel8 (R99H.1 RL2H.8)
DAC_OUT_N9: Switch_Matrix_32_2 (J1.43), Relay_channel9 (R99I.1 RL2I.8)
DAC_OUT_N10: Switch_Matrix_32_2 (J1.44), Relay_channel10 (R99J.1 RL2J.8)
DAC_OUT_N11: Switch_Matrix_32_2 (J1.45), Relay_channel11 (R99K.1 RL2K.8)
DAC_OUT_N12: Switch_Matrix_32_2 (J1.46), Relay_channel12 (R99L.1 RL2L.8)
DAC_OUT_N13: Switch_Matrix_32_2 (J1.47), Relay_channel13 (R99M.1 RL2M.8)
DAC_OUT_N14: Switch_Matrix_32_2 (J1.48), Relay_channel14 (R99N.1 RL2N.8)
DAC_OUT_N15: Switch_Matrix_32_2 (J1.49), Relay_channel15 (R99O.1 RL2O.8)
DAC_OUT_N16: Switch_Matrix_32_2 (J1.50), Relay_channel16 (R99P.1 RL2P.8)
DAC_OUT_N17: Switch_Matrix_32_2 (J1.53), Relay_channel17 (R99Q.1 RL2Q.8)
DAC_OUT_N18: Switch_Matrix_32_2 (J1.54), Relay_channel18 (R99R.1 RL2R.8)
DAC_OUT_N19: Switch_Matrix_32_2 (J1.55), Relay_channel19 (R99S.1 RL2S.8)
DAC_OUT_N20: Switch_Matrix_32_2 (J1.56), Relay_channel20 (R99T.1 RL2T.8)
DAC_OUT_N21: Switch_Matrix_32_2 (J1.57), Relay_channel21 (R99U.1 RL2U.8)
DAC_OUT_N22: Switch_Matrix_32_2 (J1.58), Relay_channel22 (R99V.1 RL2V.8)
DAC_OUT_N23: Switch_Matrix_32_2 (J1.59), Relay_channel23 (R99W.1 RL2W.8)
DAC_OUT_N24: Switch_Matrix_32_2 (J1.60), Relay_channel24 (R99X.1 RL2X.8)
DAC_OUT_N25: Switch_Matrix_32_2 (J1.61), Relay_channel25 (R99Y.1 RL2Y.8)
DAC_OUT_N26: Switch_Matrix_32_2 (J1.62), Relay_channel26 (R99Z.1 RL2Z.8)
DAC_OUT_N27: Switch_Matrix_32_2 (J1.63), Relay_channel27 (R9927.1 RL227.8)
DAC_OUT_N28: Switch_Matrix_32_2 (J1.64), Relay_channel28 (R9928.1 RL228.8)
DAC_OUT_N29: Switch_Matrix_32_2 (J1.65), Relay_channel29 (R9929.1 RL229.8)
DAC_OUT_N30: Switch_Matrix_32_2 (J1.66), Relay_channel30 (R9930.1 RL230.8)
DAC_OUT_N31: Switch_Matrix_32_2 (J1.67), Relay_channel31 (R9931.1 RL231.8)
DAC_OUT_N32: Switch_Matrix_32_2 (J1.68), Relay_channel32 (R9932.1 RL232.8)
DAC_OUT_P1: Switch_Matrix_32_2 (J1.1), Relay_channel1 (R98A.1 RL2A.2)
DAC_OUT_P2: Switch_Matrix_32_2 (J1.2), Relay_channel2 (R98B.1 RL2B.2)
DAC_OUT_P3: Switch_Matrix_32_2 (J1.3), Relay_channel3 (R98C.1 RL2C.2)
DAC_OUT_P4: Switch_Matrix_32_2 (J1.4), Relay_channel4 (R98D.1 RL2D.2)
DAC_OUT_P5: Switch_Matrix_32_2 (J1.5), Relay_channel5 (R98E.1 RL2E.2)
DAC_OUT_P6: Switch_Matrix_32_2 (J1.6), Relay_channel6 (R98F.1 RL2F.2)
DAC_OUT_P7: Switch_Matrix_32_2 (J1.7), Relay_channel7 (R98G.1 RL2G.2)
DAC_OUT_P8: Switch_Matrix_32_2 (J1.8), Relay_channel8 (R98H.1 RL2H.2)
DAC_OUT_P9: Switch_Matrix_32_2 (J1.9), Relay_channel9 (R98I.1 RL2I.2)
DAC_OUT_P10: Switch_Matrix_32_2 (J1.10), Relay_channel10 (R98J.1 RL2J.2)
DAC_OUT_P11: Switch_Matrix_32_2 (J1.11), Relay_channel11 (R98K.1 RL2K.2)
DAC_OUT_P12: Switch_Matrix_32_2 (J1.12), Relay_channel12 (R98L.1 RL2L.2)
DAC_OUT_P13: Switch_Matrix_32_2 (J1.13), Relay_channel13 (R98M.1 RL2M.2)
DAC_OUT_P14: Switch_Matrix_32_2 (J1.14), Relay_channel14 (R98N.1 RL2N.2)
DAC_OUT_P15: Switch_Matrix_32_2 (J1.15), Relay_channel15 (R98O.1 RL2O.2)
DAC_OUT_P16: Switch_Matrix_32_2 (J1.16), Relay_channel16 (R98P.1 RL2P.2)
DAC_OUT_P17: Switch_Matrix_32_2 (J1.19), Relay_channel17 (R98Q.1 RL2Q.2)
DAC_OUT_P18: Switch_Matrix_32_2 (J1.20), Relay_channel18 (R98R.1 RL2R.2)
DAC_OUT_P19: Switch_Matrix_32_2 (J1.21), Relay_channel19 (R98S.1 RL2S.2)
DAC_OUT_P20: Switch_Matrix_32_2 (J1.22), Relay_channel20 (R98T.1 RL2T.2)
DAC_OUT_P21: Switch_Matrix_32_2 (J1.23), Relay_channel21 (R98U.1 RL2U.2)
DAC_OUT_P22: Switch_Matrix_32_2 (J1.24), Relay_channel22 (R98V.1 RL2V.2)
DAC_OUT_P23: Switch_Matrix_32_2 (J1.25), Relay_channel23 (R98W.1 RL2W.2)
DAC_OUT_P24: Switch_Matrix_32_2 (J1.26), Relay_channel24 (R98X.1 RL2X.2)
DAC_OUT_P25: Switch_Matrix_32_2 (J1.27), Relay_channel25 (R98Y.1 RL2Y.2)
DAC_OUT_P26: Switch_Matrix_32_2 (J1.28), Relay_channel26 (R98Z.1 RL2Z.2)
DAC_OUT_P27: Switch_Matrix_32_2 (J1.29), Relay_channel27 (R9827.1 RL227.2)
DAC_OUT_P28: Switch_Matrix_32_2 (J1.30), Relay_channel28 (R9828.1 RL228.2)
DAC_OUT_P29: Switch_Matrix_32_2 (J1.31), Relay_channel29 (R9829.1 RL229.2)
DAC_OUT_P30: Switch_Matrix_32_2 (J1.32), Relay_channel30 (R9830.1 RL230.2)
DAC_OUT_P31: Switch_Matrix_32_2 (J1.33), Relay_channel31 (R9831.1 RL231.2)
DAC_OUT_P32: Switch_Matrix_32_2 (J1.34), Relay_channel32 (R9832.1 RL232.2)
DESER-CSn: Switch_Matrix_32_2_EEM (IC6.1 IC8.14), CTRLA (IC7A.12 IC9A.12 IC10A.12 IC11A.12)
DESER-CSn: Switch_Matrix_32_2_EEM (IC6.4 IC8.15), CTRLB (IC7B.12 IC9B.12 IC10B.12 IC11B.12)
DESER-MISO: Switch_Matrix_32_2_EEM (IC6.2), CTRLA (IC9A.9)
DESER-MISO: Switch_Matrix_32_2_EEM (IC6.5), CTRLB (IC9B.9)
DESER-MOSI: Switch_Matrix_32_2_EEM (IC1.14), CTRLA (IC10A.14), CTRLB (IC10B.14)
DESER-SCK: Switch_Matrix_32_2_EEM (IC1.15), CTRLA (IC7A.11 IC9A.11 IC10A.11 IC11A.11), CTRLB (IC7B.11 IC9B.11 IC10B.11 IC11B.11)
EEM0_0_N: Switch_Matrix_32_2_EEM (IC2.4 J6.3 R9.2), DIOT_Connectors_P1_P6 (R161.2)
EEM0_0_P: Switch_Matrix_32_2_EEM (IC2.3 J6.2 R9.1), DIOT_Connectors_P1_P6 (R145.2)
EEM0_1_N: Switch_Matrix_32_2_EEM (IC2.1 J6.6 R7.1), DIOT_Connectors_P1_P6 (R162.2)
EEM0_1_P: Switch_Matrix_32_2_EEM (IC2.2 J6.5 R7.2), DIOT_Connectors_P1_P6 (R146.2)
EEM0_2_N: Switch_Matrix_32_2_EEM (IC3.7 J6.9), DIOT_Connectors_P1_P6 (R163.2)
EEM0_2_P: Switch_Matrix_32_2_EEM (IC3.8 J6.8), DIOT_Connectors_P1_P6 (R147.2)
EEM0_3_N: Switch_Matrix_32_2_EEM (IC4.1 J6.12 R12.1), DIOT_Connectors_P1_P6 (R164.2)
EEM0_3_P: Switch_Matrix_32_2_EEM (IC4.2 J6.11 R12.2), DIOT_Connectors_P1_P6 (R148.2)
EEM0_4_N: Switch_Matrix_32_2_EEM (IC4.4 J6.15 R14.2), DIOT_Connectors_P1_P6 (R167.2)
EEM0_4_P: Switch_Matrix_32_2_EEM (IC4.3 J6.14 R14.1), DIOT_Connectors_P1_P6 (R149.2)
EEM0_5_N: Switch_Matrix_32_2_EEM (IC5.4 J6.18 R88.2), DIOT_Connectors_P1_P6 (R168.2)
EEM0_5_P: Switch_Matrix_32_2_EEM (IC5.3 J6.17 R88.1), DIOT_Connectors_P1_P6 (R150.2)
EEM0_6_N: Switch_Matrix_32_2_EEM (J6.21), DIOT_Connectors_P1_P6 (R169.2)
EEM0_6_P: Switch_Matrix_32_2_EEM (J6.20), DIOT_Connectors_P1_P6 (R97.2)
EEM0_7_N: Switch_Matrix_32_2_EEM (J6.24), DIOT_Connectors_P1_P6 (R170.2)
EEM0_7_P: Switch_Matrix_32_2_EEM (J6.23), DIOT_Connectors_P1_P6 (R152.2)
I2C0_SCL: Switch_Matrix_32_2_EEM (9 pins), DIOT_Connectors_P1_P6 (IC16.9 IC16.10)
I2C0_SDA: Switch_Matrix_32_2_EEM (9 pins), DIOT_Connectors_P1_P6 (IC16.2 IC16.3)
NetIC7A_13: Switch_Matrix_32_2_EEM (IC8.4), CTRLA (IC7A.13 IC9A.13 IC10A.13 IC11A.13), CTRLB (IC7B.13 IC9B.13 IC10B.13 IC11B.13)
NetIC22_5: Switch_Matrix_32_2_EEM (R86.2 R89.2), Switch_Matrix_32_2_Supply (IC22.5), DIOT_Connectors_P1_P6 (R113.2)
PORT_NA: Switch_Matrix_32_2 (J9.1 R94.2), Relay_channel1 (RL1A.7), Relay_channel2 (RL1B.7), Relay_channel3 (RL1C.7), Relay_channel4 (RL1D.7), Relay_channel5 (RL1E.7), Relay_channel6 (RL1F.7), Relay_channel7 (RL1G.7), Relay_channel8 (RL1H.7), Relay_channel9 (RL1I.7), Relay_channel10 (RL1J.7), Relay_channel11 (RL1K.7), Relay_channel12 (RL1L.7), Relay_channel13 (RL1M.7), Relay_channel14 (RL1N.7), Relay_channel15 (RL1O.7), Relay_channel16 (RL1P.7), Relay_channel17 (RL1Q.7), Relay_channel18 (RL1R.7), Relay_channel19 (RL1S.7), Relay_channel20 (RL1T.7), Relay_channel21 (RL1U.7), Relay_channel22 (RL1V.7), Relay_channel23 (RL1W.7), Relay_channel24 (RL1X.7), Relay_channel25 (RL1Y.7), Relay_channel26 (RL1Z.7), Relay_channel27 (RL127.7), Relay_channel28 (RL128.7), Relay_channel29 (RL129.7), Relay_channel30 (RL130.7), Relay_channel31 (RL131.7), Relay_channel32 (RL132.7)
PORT_NB: Switch_Matrix_32_2 (J12.1 R100.2), Relay_channel1 (RL2A.7), Relay_channel2 (RL2B.7), Relay_channel3 (RL2C.7), Relay_channel4 (RL2D.7), Relay_channel5 (RL2E.7), Relay_channel6 (RL2F.7), Relay_channel7 (RL2G.7), Relay_channel8 (RL2H.7), Relay_channel9 (RL2I.7), Relay_channel10 (RL2J.7), Relay_channel11 (RL2K.7), Relay_channel12 (RL2L.7), Relay_channel13 (RL2M.7), Relay_channel14 (RL2N.7), Relay_channel15 (RL2O.7), Relay_channel16 (RL2P.7), Relay_channel17 (RL2Q.7), Relay_channel18 (RL2R.7), Relay_channel19 (RL2S.7), Relay_channel20 (RL2T.7), Relay_channel21 (RL2U.7), Relay_channel22 (RL2V.7), Relay_channel23 (RL2W.7), Relay_channel24 (RL2X.7), Relay_channel25 (RL2Y.7), Relay_channel26 (RL2Z.7), Relay_channel27 (RL227.7), Relay_channel28 (RL228.7), Relay_channel29 (RL229.7), Relay_channel30 (RL230.7), Relay_channel31 (RL231.7), Relay_channel32 (RL232.7)
PORT_PA: Switch_Matrix_32_2 (J2.1), Relay_channel1 (RL1A.3), Relay_channel2 (RL1B.3), Relay_channel3 (RL1C.3), Relay_channel4 (RL1D.3), Relay_channel5 (RL1E.3), Relay_channel6 (RL1F.3), Relay_channel7 (RL1G.3), Relay_channel8 (RL1H.3), Relay_channel9 (RL1I.3), Relay_channel10 (RL1J.3), Relay_channel11 (RL1K.3), Relay_channel12 (RL1L.3), Relay_channel13 (RL1M.3), Relay_channel14 (RL1N.3), Relay_channel15 (RL1O.3), Relay_channel16 (RL1P.3), Relay_channel17 (RL1Q.3), Relay_channel18 (RL1R.3), Relay_channel19 (RL1S.3), Relay_channel20 (RL1T.3), Relay_channel21 (RL1U.3), Relay_channel22 (RL1V.3), Relay_channel23 (RL1W.3), Relay_channel24 (RL1X.3), Relay_channel25 (RL1Y.3), Relay_channel26 (RL1Z.3), Relay_channel27 (RL127.3), Relay_channel28 (RL128.3), Relay_channel29 (RL129.3), Relay_channel30 (RL130.3), Relay_channel31 (RL131.3), Relay_channel32 (RL132.3)
PORT_PB: Switch_Matrix_32_2 (J3.1), Relay_channel1 (RL2A.3), Relay_channel2 (RL2B.3), Relay_channel3 (RL2C.3), Relay_channel4 (RL2D.3), Relay_channel5 (RL2E.3), Relay_channel6 (RL2F.3), Relay_channel7 (RL2G.3), Relay_channel8 (RL2H.3), Relay_channel9 (RL2I.3), Relay_channel10 (RL2J.3), Relay_channel11 (RL2K.3), Relay_channel12 (RL2L.3), Relay_channel13 (RL2M.3), Relay_channel14 (RL2N.3), Relay_channel15 (RL2O.3), Relay_channel16 (RL2P.3), Relay_channel17 (RL2Q.3), Relay_channel18 (RL2R.3), Relay_channel19 (RL2S.3), Relay_channel20 (RL2T.3), Relay_channel21 (RL2U.3), Relay_channel22 (RL2V.3), Relay_channel23 (RL2W.3), Relay_channel24 (RL2X.3), Relay_channel25 (RL2Y.3), Relay_channel26 (RL2Z.3), Relay_channel27 (RL227.3), Relay_channel28 (RL228.3), Relay_channel29 (RL229.3), Relay_channel30 (RL230.3), Relay_channel31 (RL231.3), Relay_channel32 (RL232.3)

## Assembly variants
STD: not fitted C11 C15 IC32 R98A R98AA R98AB R98AC R98AD R98AE R98AF R98B R98C R98D R98E R98F R98G R98H R98I R98J R98K R98L R98M R98N R98O R98P R98Q R98R R98S R98T R98U R98V R98W R98X R98Y R98Z R99A R99AA R99AB R99AC R99AD R99AE R99AF R99B R99C R99D R99E R99F R99G R99H R99I R99J R99K R99L R99M R99N R99O R99P R99Q R99R R99S R99T R99U R99V R99W R99X R99Y R99Z